# Altium schematic sheet 6_DRAMBanks.SchDoc: DRAM Signals (Banks 34-35)
size Letter; Date: 12/28/2025; Author: Praveen Perera; DrawnBy: Praveen Perera; Engineer: Praveen Perera; Revision: 0; SheetNumber: 6; SheetTotal: 8
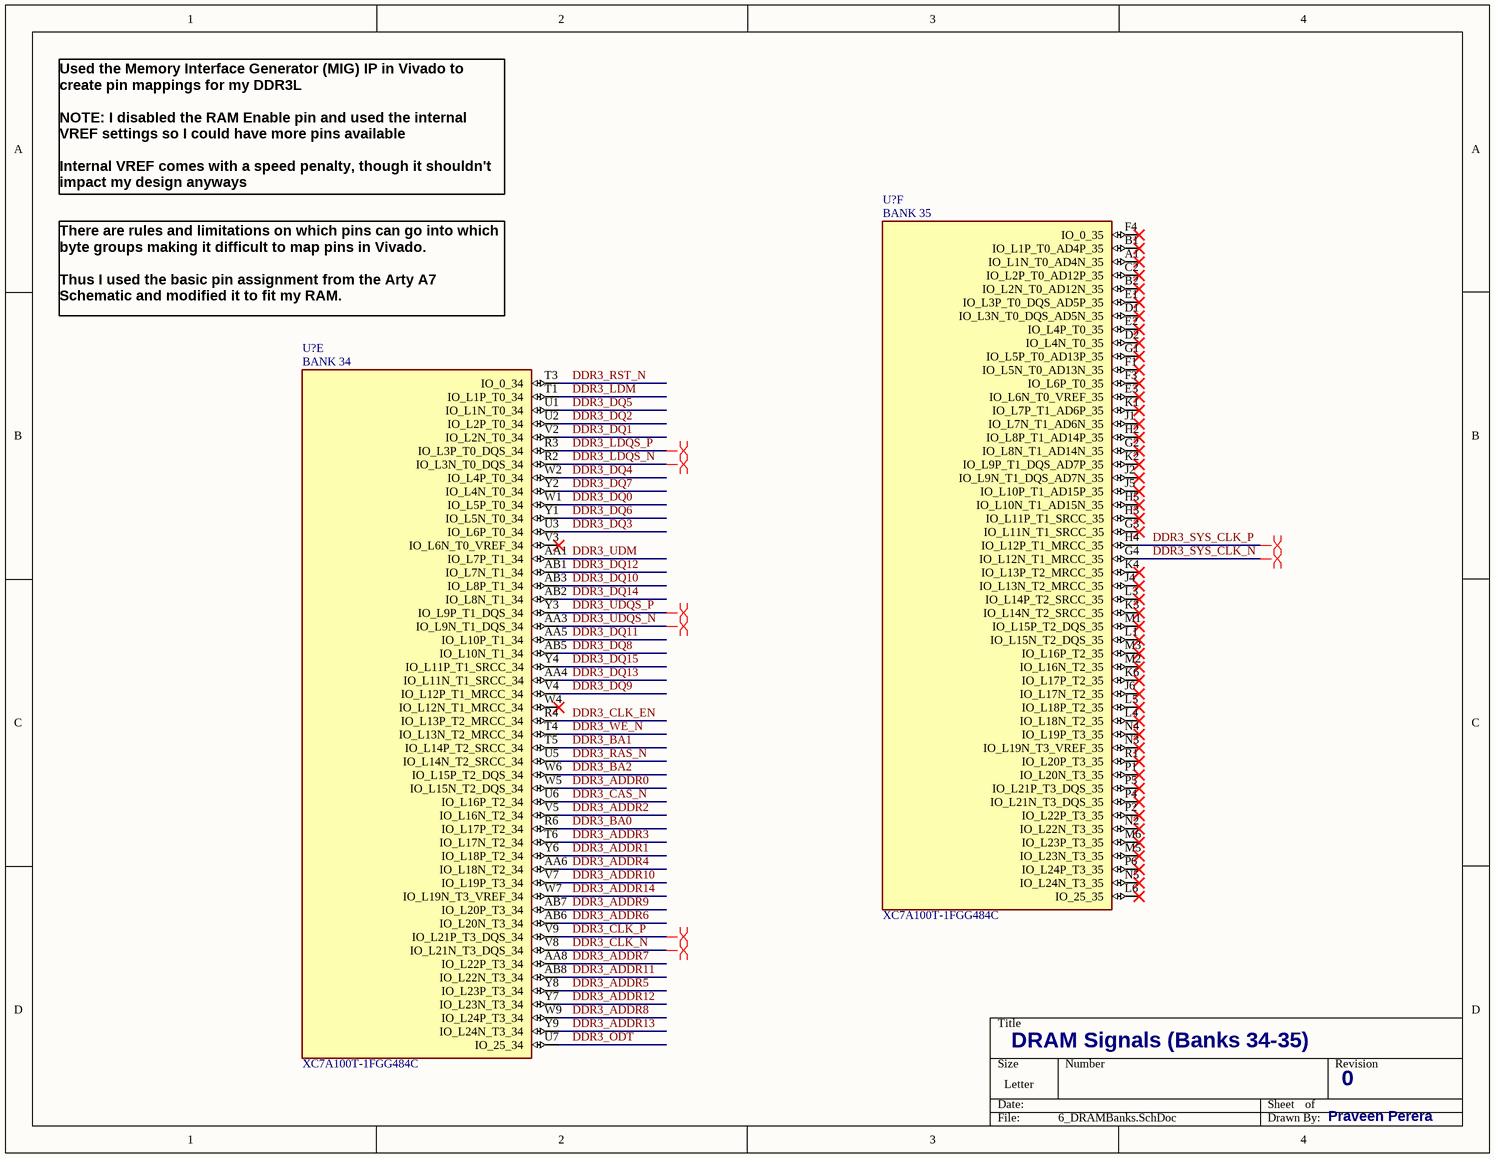
[diagram p0: 6_DRAMBanks.SchDoc]

## Parts
(Parts that share a designator on the sheet are numbered #1, #2 ... from top to bottom, then left to right.)
U?#1  XC7A100T-1FGG484C  [BGA484C100P22X22_2300X2300X260N]  (part F of 14)
U?#2  XC7A100T-1FGG484C  [BGA484C100P22X22_2300X2300X260N]  (part E of 14)

## Nets
DDR3_ADDR0: U?#2.W5(IO_L15N_T2_DQS_34)
DDR3_ADDR1: U?#2.Y6(IO_L18P_T2_34)
DDR3_ADDR2: U?#2.V5(IO_L16N_T2_34)
DDR3_ADDR3: U?#2.T6(IO_L17N_T2_34)
DDR3_ADDR4: U?#2.AA6(IO_L18N_T2_34)
DDR3_ADDR5: U?#2.Y8(IO_L23P_T3_34)
DDR3_ADDR6: U?#2.AB6(IO_L20N_T3_34)
DDR3_ADDR7: U?#2.AA8(IO_L22P_T3_34)
DDR3_ADDR8: U?#2.W9(IO_L24P_T3_34)
DDR3_ADDR9: U?#2.AB7(IO_L20P_T3_34)
DDR3_ADDR10: U?#2.V7(IO_L19P_T3_34)
DDR3_ADDR11: U?#2.AB8(IO_L22N_T3_34)
DDR3_ADDR12: U?#2.Y7(IO_L23N_T3_34)
DDR3_ADDR13: U?#2.Y9(IO_L24N_T3_34)
DDR3_ADDR14: U?#2.W7(IO_L19N_T3_VREF_34)
DDR3_BA0: U?#2.R6(IO_L17P_T2_34)
DDR3_BA1: U?#2.T5(IO_L14P_T2_SRCC_34)
DDR3_BA2: U?#2.W6(IO_L15P_T2_DQS_34)
DDR3_CAS_N: U?#2.U6(IO_L16P_T2_34)
DDR3_CLK_EN: U?#2.R4(IO_L13P_T2_MRCC_34)
DDR3_CLK_N: U?#2.V8(IO_L21N_T3_DQS_34)
DDR3_CLK_P: U?#2.V9(IO_L21P_T3_DQS_34)
DDR3_DQ0: U?#2.W1(IO_L5P_T0_34)
DDR3_DQ1: U?#2.V2(IO_L2N_T0_34)
DDR3_DQ2: U?#2.U2(IO_L2P_T0_34)
DDR3_DQ3: U?#2.U3(IO_L6P_T0_34)
DDR3_DQ4: U?#2.W2(IO_L4P_T0_34)
DDR3_DQ5: U?#2.U1(IO_L1N_T0_34)
DDR3_DQ6: U?#2.Y1(IO_L5N_T0_34)
DDR3_DQ7: U?#2.Y2(IO_L4N_T0_34)
DDR3_DQ8: U?#2.AB5(IO_L10N_T1_34)
DDR3_DQ9: U?#2.V4(IO_L12P_T1_MRCC_34)
DDR3_DQ10: U?#2.AB3(IO_L8P_T1_34)
DDR3_DQ11: U?#2.AA5(IO_L10P_T1_34)
DDR3_DQ12: U?#2.AB1(IO_L7N_T1_34)
DDR3_DQ13: U?#2.AA4(IO_L11N_T1_SRCC_34)
DDR3_DQ14: U?#2.AB2(IO_L8N_T1_34)
DDR3_DQ15: U?#2.Y4(IO_L11P_T1_SRCC_34)
DDR3_LDM: U?#2.T1(IO_L1P_T0_34)
DDR3_LDQS_N: U?#2.R2(IO_L3N_T0_DQS_34)
DDR3_LDQS_P: U?#2.R3(IO_L3P_T0_DQS_34)
DDR3_ODT: U?#2.U7(IO_25_34)
DDR3_RAS_N: U?#2.U5(IO_L14N_T2_SRCC_34)
DDR3_RST_N: U?#2.T3(IO_0_34)
DDR3_SYS_CLK_N: U?#1.G4(IO_L12N_T1_MRCC_35)
DDR3_SYS_CLK_P: U?#1.H4(IO_L12P_T1_MRCC_35)
DDR3_UDM: U?#2.AA1(IO_L7P_T1_34)
DDR3_UDQS_N: U?#2.AA3(IO_L9N_T1_DQS_34)
DDR3_UDQS_P: U?#2.Y3(IO_L9P_T1_DQS_34)
DDR3_WE_N: U?#2.T4(IO_L13N_T2_MRCC_34)

Not connected (* = marked no-connect by the designer): U?#1 A1(IO_L1N_T0_AD4N_35)* B1(IO_L1P_T0_AD4P_35)* B2(IO_L2N_T0_AD12N_35)* C2(IO_L2P_T0_AD12P_35)* D1(IO_L3N_T0_DQS_AD5N_35)* D2(IO_L4N_T0_35)* E1(IO_L3P_T0_DQS_AD5P_35)* E2(IO_L4P_T0_35)* E3(IO_L6N_T0_VREF_35)* F1(IO_L5N_T0_AD13N_35)* F3(IO_L6P_T0_35)* F4(IO_0_35)* G1(IO_L5P_T0_AD13P_35)* G2(IO_L8N_T1_AD14N_35)* G3(IO_L11N_T1_SRCC_35)* H2(IO_L8P_T1_AD14P_35)* H3(IO_L11P_T1_SRCC_35)* H5(IO_L10N_T1_AD15N_35)* J1(IO_L7N_T1_AD6N_35)* J2(IO_L9N_T1_DQS_AD7N_35)* J4(IO_L13N_T2_MRCC_35)* J5(IO_L10P_T1_AD15P_35)* J6(IO_L17N_T2_35)* K1(IO_L7P_T1_AD6P_35)* K2(IO_L9P_T1_DQS_AD7P_35)* K3(IO_L14N_T2_SRCC_35)* K4(IO_L13P_T2_MRCC_35)* K6(IO_L17P_T2_35)* L1(IO_L15N_T2_DQS_35)* L3(IO_L14P_T2_SRCC_35)* L4(IO_L18N_T2_35)* L5(IO_L18P_T2_35)* L6(IO_25_35)* M1(IO_L15P_T2_DQS_35)* M2(IO_L16N_T2_35)* M3(IO_L16P_T2_35)* M5(IO_L23N_T3_35)* M6(IO_L23P_T3_35)* N2(IO_L22N_T3_35)* N3(IO_L19N_T3_VREF_35)* N4(IO_L19P_T3_35)* N5(IO_L24N_T3_35)* P1(IO_L20N_T3_35)* P2(IO_L22P_T3_35)* P4(IO_L21N_T3_DQS_35)* P5(IO_L21P_T3_DQS_35)* P6(IO_L24P_T3_35)* R1(IO_L20P_T3_35)*; U?#2 V3(IO_L6N_T0_VREF_34)* W4(IO_L12N_T1_MRCC_34)*

## Layout directives
differential pair: DDR3_CLK_N, DDR3_CLK_P, DDR3_LDQS_N, DDR3_LDQS_P, DDR3_SYS_CLK_N, DDR3_SYS_CLK_P, DDR3_UDQS_N, DDR3_UDQS_P

## Notes on the sheet
- Used the Memory Interface Generator (MIG) IP in Vivado to create pin mappings for my DDR3L
  NOTE: I disabled the RAM Enable pin and used the internal VREF settings so I could have more pins available
  Internal VREF comes with a speed penalty, though it shouldn't impact my design anyways
- There are rules and limitations on which pins can go into which byte groups making it difficult to map pins in Vivado.
  Thus I used the basic pin assignment from the Arty A7 Schematic and modified it to fit my RAM.
- (in symbol XC7A100T-1FGG484C, part E) BANK 34
- (in symbol XC7A100T-1FGG484C, part F) BANK 35

## Library data of the parts
U?#1 U?#2 = XC7A100T-1FGG484C: Artix-7 Field Programmable Gate Array (FPGA) IC 285 4976640 101440 484-BBGA; MF: Xilinx Inc.; Value: *; Check_prices: https://www.snapeda.com/parts/XC7A100T-1FGG484C/Xilinx/view-part/?ref=eda; MP: XC7A100T-1FGG484C; SnapEDA_Link: https://www.snapeda.com/parts/XC7A100T-1FGG484C/Xilinx/view-part/?ref=snap; Package: FBGA-484 Xilinx